# Altium schematic sheet Power.SchDoc
size A4
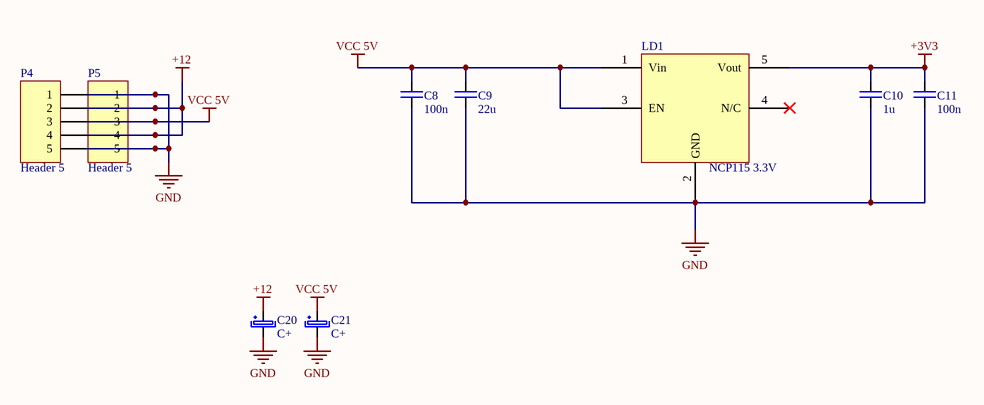
[diagram p0: Power.SchDoc]

## Parts
C8  100n  [R1005_0402i_L]
C9  22u  [C1608_0603I_L]
C10  1u  [R1005_0402i_L]
C11  100n  [R1005_0402i_L]
C20  C+  [C AlElko 5x11 R2]
C21  C+  [C AlElko 5x11 R2]
LD1  NCP115 3.3V  [TSOP95P280X110-6L]
P4  Header 5  [HDR1X5]
P5  Header 5  [HDR1X5]

## Nets
+3V3: C10.1 C11.1 LD1.5(Vout)
+12: C20.1 P4.2 P4.4 P5.2 P5.4
GND: C8.2 C9.2 C10.2 C11.2 C20.2 C21.2 LD1.2(GND) P4.1 P4.5 P5.1 P5.5
VCC 5V: C8.1 C9.1 C21.1 LD1.1(Vin) LD1.3(EN) P4.3 P5.3

Not connected (* = marked no-connect by the designer): LD1 4(N/C)*

## Library data of the parts
C8-C11 = C: Capacitor
C20 C21 = C+: Capacitor Polarized
P4 P5 = Header 5: Header, 5-Pin; LatestRevisionDate: 17-Jul-2002; LatestRevisionNote: Re-released for DXP Platform.; Publisher: Altium Limited